# EAGLE design p2cled-001 (EAGLE 9.5.2)
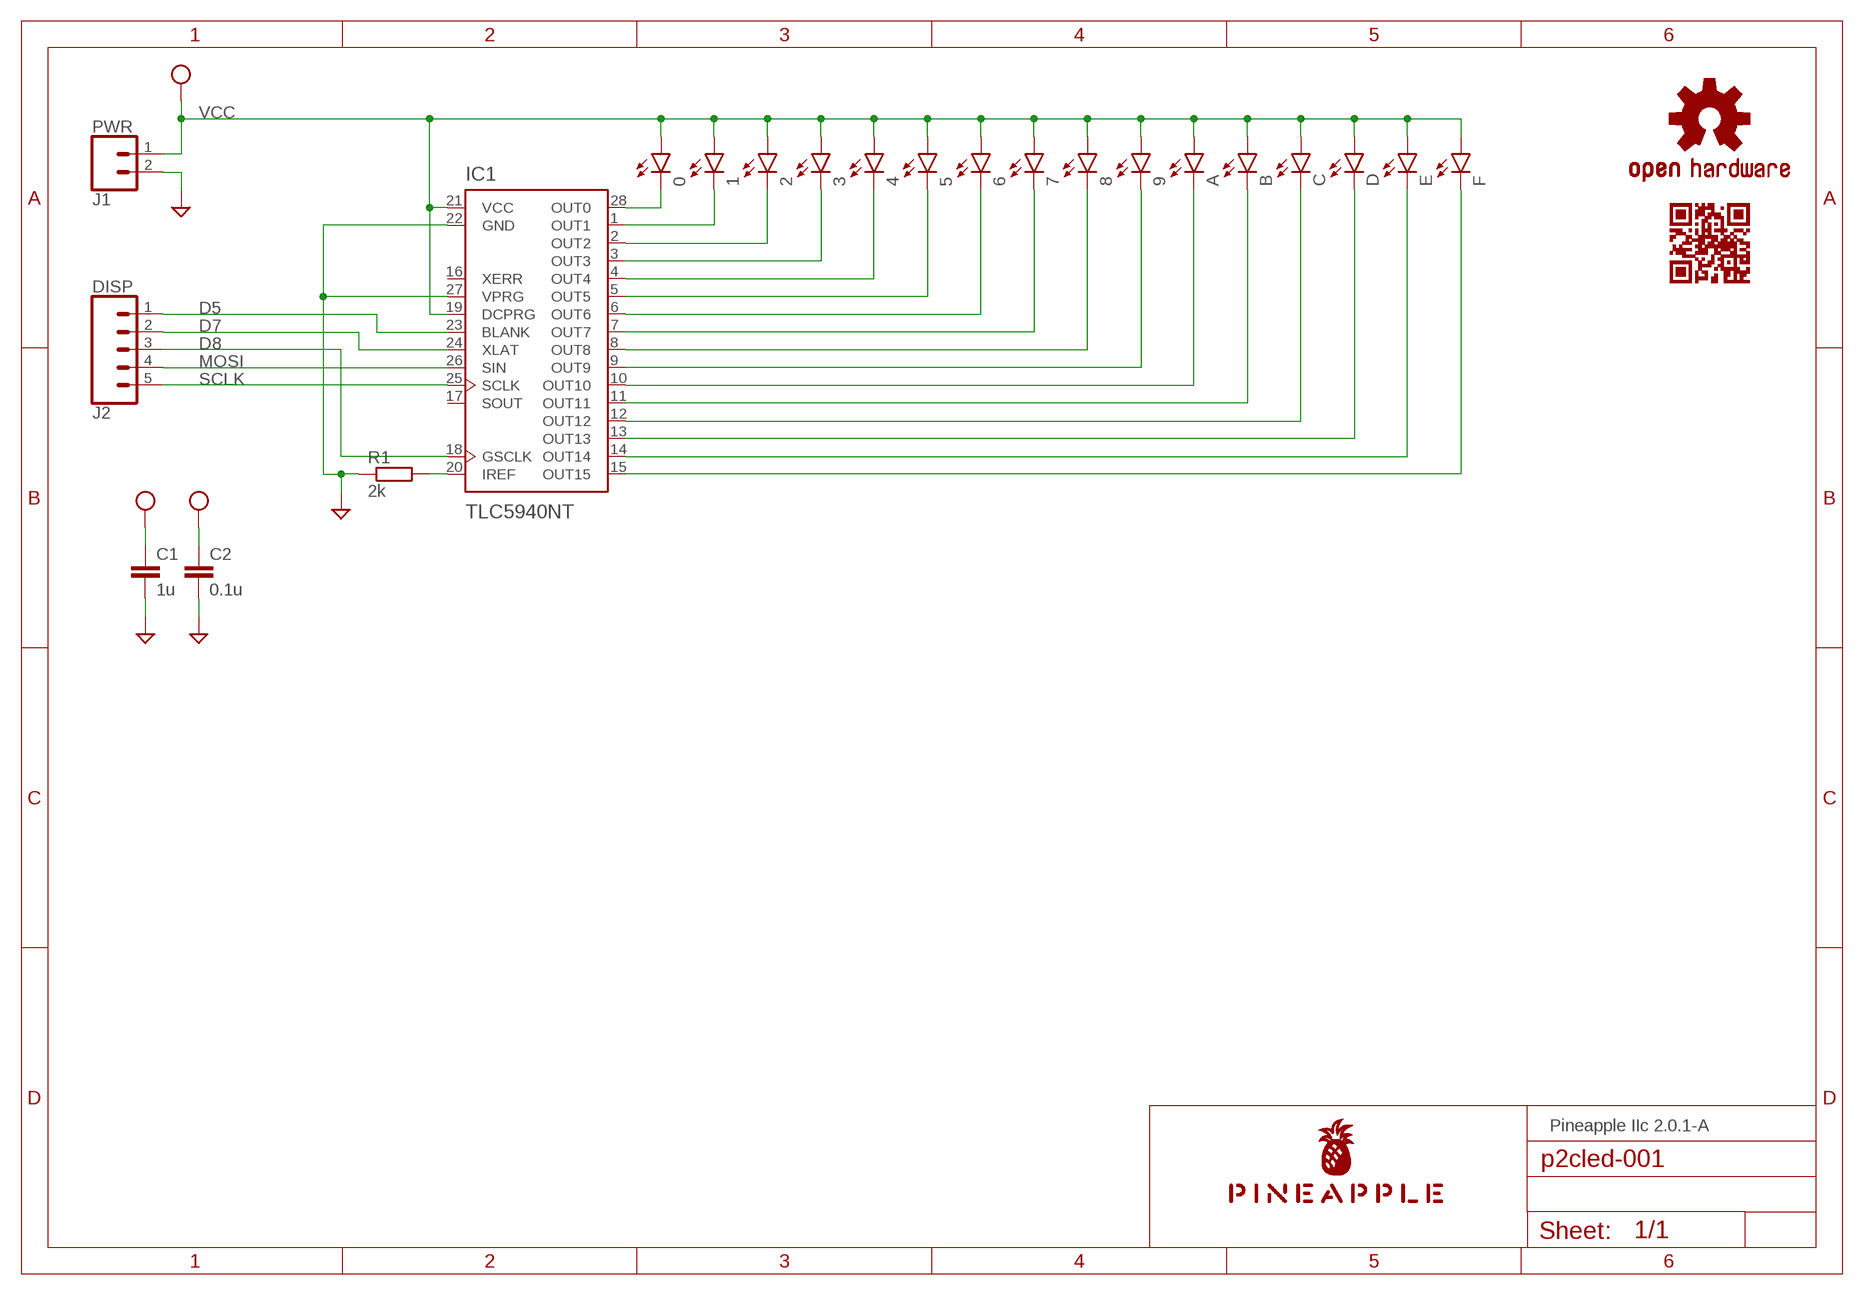
[diagram p0: schematic, sheet 1]

## Parts
0  LEDB152  [Q62902-B152]
1  LEDB152  [Q62902-B152]
2  LEDB152  [Q62902-B152]
3  LEDB152  [Q62902-B152]
4  LEDB152  [Q62902-B152]
5  LEDB152  [Q62902-B152]
6  LEDB152  [Q62902-B152]
7  LEDB152  [Q62902-B152]
8  LEDB152  [Q62902-B152]
9  LEDB152  [Q62902-B152]
A  LEDB152  [Q62902-B152]
B  LEDB152  [Q62902-B152]
C  LEDB152  [Q62902-B152]
C1  1u  C-EU025-024X044  [C025-024X044]
C2  0.1u  C-EU025-024X044  [C025-024X044]
D  LEDB152  [Q62902-B152]
E  LEDB152  [Q62902-B152]
F  LEDB152  [Q62902-B152]
IC1  TLC5940NT  [DIL28-3]
J1  PWR  CONN_02JST-PTH-2  [JST-2-PTH]
J2  DISP  CONN_05JST  [JST-5-PTH]
LOGO1  OSHW-LOGOS-COPPER  [OSHW-LOGO-S_COPPER]
R1  2k  R-EU_0204/5  [0204/5]
U$1  PINEAPPLE450_SILK  [PINEAPPLE450_SILK]
U$4  CARDQRCODE450_SILK  [CARDQRCODE450_SILK]

## Nets
D5: IC1.23(BLANK) J2.1
D7: IC1.24(XLAT) J2.2
D8: IC1.18(GSCLK) J2.3
GND [ground]: C1.2 C2.2 IC1.22(GND) IC1.27(VPRG) J1.2 R1.1
MOSI: IC1.26(SIN) J2.4
N$1: 0.K(C) IC1.28(OUT0)
N$2: 1.K(C) IC1.1(OUT1)
N$3: 2.K(C) IC1.2(OUT2)
N$4: 3.K(C) IC1.3(OUT3)
N$5: 4.K(C) IC1.4(OUT4)
N$6: 5.K(C) IC1.5(OUT5)
N$7: 6.K(C) IC1.6(OUT6)
N$8: 7.K(C) IC1.7(OUT7)
N$9: 8.K(C) IC1.8(OUT8)
N$10: 9.K(C) IC1.9(OUT9)
N$11: A.K(C) IC1.10(OUT10)
N$12: B.K(C) IC1.11(OUT11)
N$13: C.K(C) IC1.12(OUT12)
N$14: D.K(C) IC1.13(OUT13)
N$15: E.K(C) IC1.14(OUT14)
N$16: F.K(C) IC1.15(OUT15)
N$17: IC1.20(IREF) R1.2
SCLK: IC1.25(SCLK) J2.5
VCC [power1]: 0.A 1.A 2.A 3.A 4.A 5.A 6.A 7.A 8.A 9.A A.A B.A C1.1 C2.1 C.A D.A E.A F.A IC1.19(DCPRG) IC1.21(VCC) J1.1
Unconnected: IC1.16(XERR) IC1.17(SOUT)

## Notes on the sheet
- Pineapple IIc 2.0.1-A

## Library data of the parts
0 1-9 A B C D E F = led:LED: LED OSRAM: - CHIPLED LG R971, LG N971, LY N971, LG Q971, LY Q971, LO R971, LY R971 LH N974, LH R974 LS Q976, LO Q976, LY Q976 LO Q996 - Hyper CHIPLED LW Q18S LB Q993, LB Q99A, LB R99A - SideLED LS A670, LO A670, LY A670, LG A670, LP A670 LB A673, LV A673, LT A673, LW A673 LH A674 LY A675 LS A676, LA A676, LO A676, LY A676, LW A676 LS A679, LY A679, LG A679 - Hyper Micro SIDELED® LS Y876, LA Y876, LO Y876, LY Y876 LT Y87S - SmartLED LW L88C, LW L88S LB L89C, LB L89S, LG L890 LS L89K, LO L89K, LY L89K LS L896, LA L896, LO L896, LY L896 - TOPLED LS T670, LO T670, LY T670, LG T670, LP T670 LSG T670, LSP T670, LSY T670, LOP T670, LYG T670 LG T671, LOG T671, LSG T671 LB T673, LV T673, LT T673, LW T673 LH T674 LS T676, LA T676, LO T676, LY T676, LB T676, LH T676, LSB T676, LW T676 LB T67C, LV T67C, LT T67C, LS T67K, LO T67K, LY T67K, LW E67C LS E67B, LA E67B, LO E67B, LY E67B, LB E67C, LV E67C, LT E67C LW T67C LS T679, LY T679, LG T679 LS T770, LO T770, LY T770, LG T770, LP T770 LB T773, LV T773, LT T773, LW T773 LH T774 LS E675, LA E675, LY E675, LS T675 LS T776, LA T776, LO T776, LY T776, LB T776 LHGB T686 LT T68C, LB T68C - Hyper Mini TOPLED® LB M676 - Mini TOPLED Santana® LG M470 LS M47K, LO M47K, LY M47K Source: http://www.osram.convergy.de LUXEON: - LUMILED® LXK2-PW12-R00, LXK2-PW12-S00, LXK2-PW14-U00, LXK2-PW14-V00 LXK2-PM12-R00, LXK2-PM12-S00, LXK2-PM14-U00 LXK2-PE12-Q00, LXK2-PE12-R00, LXK2-PE12-S00, LXK2-PE14-T00, LXK2-PE14-U00 LXK2-PB12-K00, LXK2-PB12-L00, LXK2-PB12-M00, LXK2-PB14-N00, LXK2-PB14-P00, LXK2-PB14-Q00 LXK2-PR12-L00, LXK2-PR12-M00, LXK2-PR14-Q00, LXK2-PR14-R00 LXK2-PD12-Q00, LXK2-PD12-R00, LXK2-PD12-S00 LXK2-PH12-R00, LXK2-PH12-S00 LXK2-PL12-P00, LXK2-PL12-Q00, LXK2-PL12-R00 Source: www.luxeon.com KINGBRIGHT: KA-3528ASYC Source: www.kingbright.com
C1 C2 = resistor:C-EU: CAPACITOR, European symbol
IC1 = tlc5940:TLC5940
J1 = SparkFun-Connectors:CONN_02: Multi connection point. Often used as Generic Header-pin footprint for 0.1 inch spaced/style header connections On any of the 0.1 inch spaced packages, you can populate with these: Break Away Headers - Straight <https://www.sparkfun.com/products/116> (PRT-00116) Break Away Male Headers - Right Angle <https://www.sparkfun.com/products/553> (PRT-00553) Female Headers <https://www.sparkfun.com/products/115> (PRT-00115) Break Away Headers - Machine Pin <https://www.sparkfun.com/products/117> (PRT-00117) Break Away Female Headers - Swiss Machine Pin <https://www.sparkfun.com/products/743> (PRT-00743) For SCREWTERMINALS and SPRING TERMINALS visit here: Screw Terimnals on SparkFun.com <https://www.sparkfun.com/search/results?term=Screw+Terminals> (5mm/3.5mm/2.54mm spacing) This device is also useful as a general connection point to wire up your design to another part of your project. Our various solder wires solder well into these plated through hole pads. Hook-Up Wire - Assortment (Stranded, 22 AWG) <https://www.sparkfun.com/products/11375> (PRT-11375) Hook-Up Wire - Assortment (Solid Core, 22 AWG) <https://www.sparkfun.com/products/11367> (PRT-11367) View the entire wire category on our website here <https://www.sparkfun.com/categories/141> Special notes: Molex polarized connector foot print use with: PRT-08233 with associated crimp pins and housings. 2.54_SCREWTERM for use with PRT-10571. 3.5mm Screw Terminal footprints for PRT-08084 5mm Screw Terminal footprints for use with PRT-08432; PROD_ID: CONN-09863; SKU: PRT-09914
J2 = SparkFun-Connectors:CONN_05: Multi connection point. Often used as Generic Header-pin footprint for 0.1 inch spaced/style header connections On any of the 0.1 inch spaced packages, you can populate with these: Break Away Headers - Straight <https://www.sparkfun.com/products/116> (PRT-00116) Break Away Male Headers - Right Angle <https://www.sparkfun.com/products/553> (PRT-00553) Female Headers <https://www.sparkfun.com/products/115> (PRT-00115) Break Away Headers - Machine Pin <https://www.sparkfun.com/products/117> (PRT-00117) Break Away Female Headers - Swiss Machine Pin <https://www.sparkfun.com/products/743> (PRT-00743) For SCREWTERMINALS and SPRING TERMINALS visit here: Screw Terimnals on SparkFun.com <https://www.sparkfun.com/search/results?term=Screw+Terminals> (5mm/3.5mm/2.54mm spacing) This device is also useful as a general connection point to wire up your design to another part of your project. Our various solder wires solder well into these plated through hole pads. Hook-Up Wire - Assortment (Stranded, 22 AWG) <https://www.sparkfun.com/products/11375> (PRT-11375) Hook-Up Wire - Assortment (Solid Core, 22 AWG) <https://www.sparkfun.com/products/11367> (PRT-11367) View the entire wire category on our website here <https://www.sparkfun.com/categories/141> Special notes: Molex polarized connector foot print use with SKU : PRT-08231 with associated crimp pins and housings. 1MM SMD Version SKU: PRT-10208; SF_ID: PRT-09917
LOGO1 = SparkFun-Aesthetics:OSHW-LOGO: Open-Source Hardware (OSHW) Logo This logo indicates the piece of hardware it is found on incorporates a OSHW license and/or adheres to the definition of open source hardware found here: http://freedomdefined.org/OSHW
R1 = resistor:R-EU_: RESISTOR, European symbol
U$1 = pineapple:PINEAPPLE450_SILK
U$4 = pineapple:CARDQRCODE450_SILK

## Net classes
0 default: width 0.152 mm, drill 0.305 mm, clearance 0.152 mm
1 ground: width 0.61 mm, drill 0.305 mm, clearance 0.152 mm
2 power1: width 0.61 mm, drill 0.305 mm, clearance 0.152 mm
3 power2: width 0.305 mm, drill 0.305 mm, clearance 0.152 mm

## Board
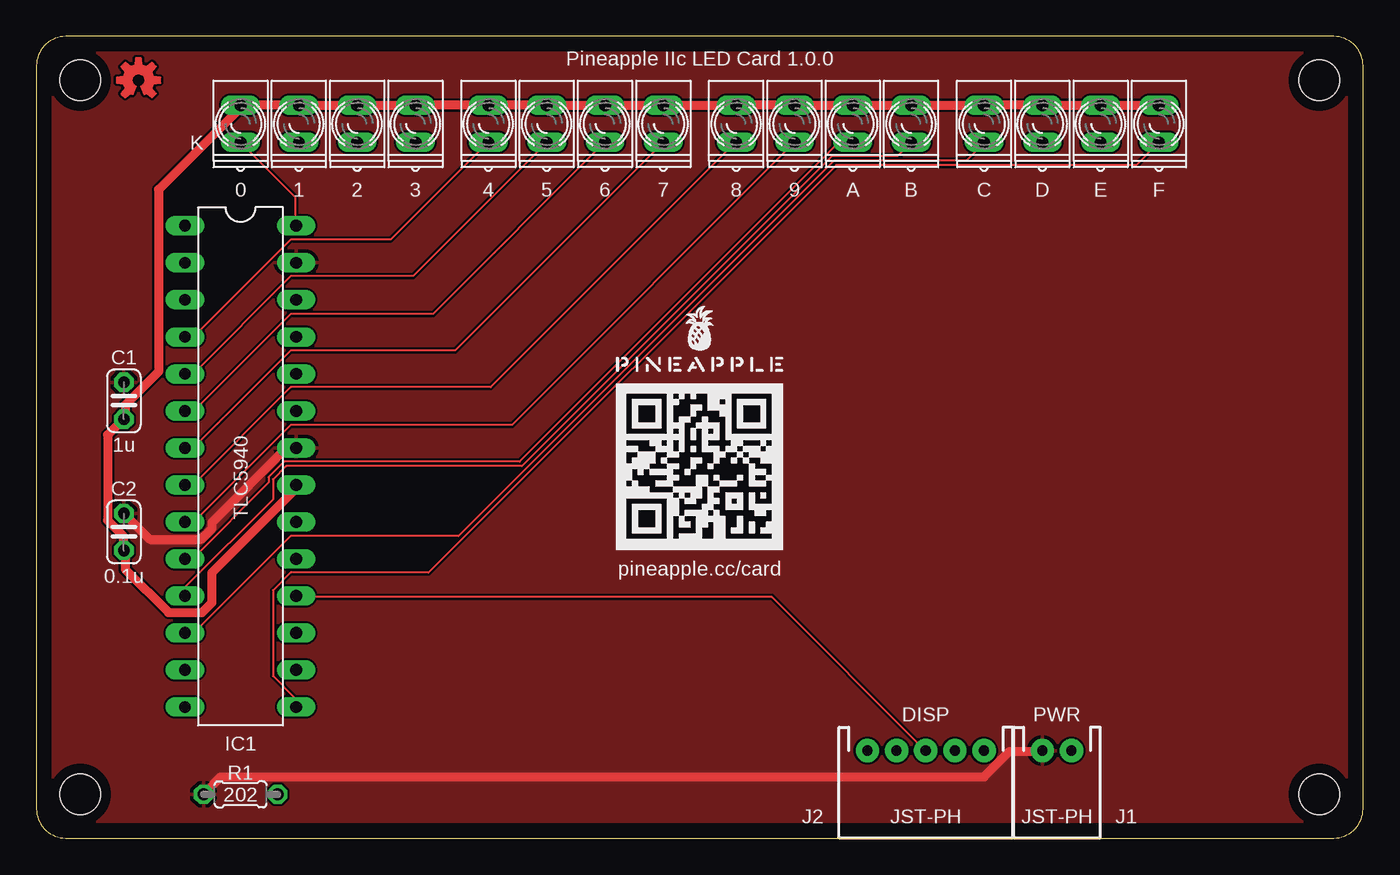
[diagram p1: board, top side]
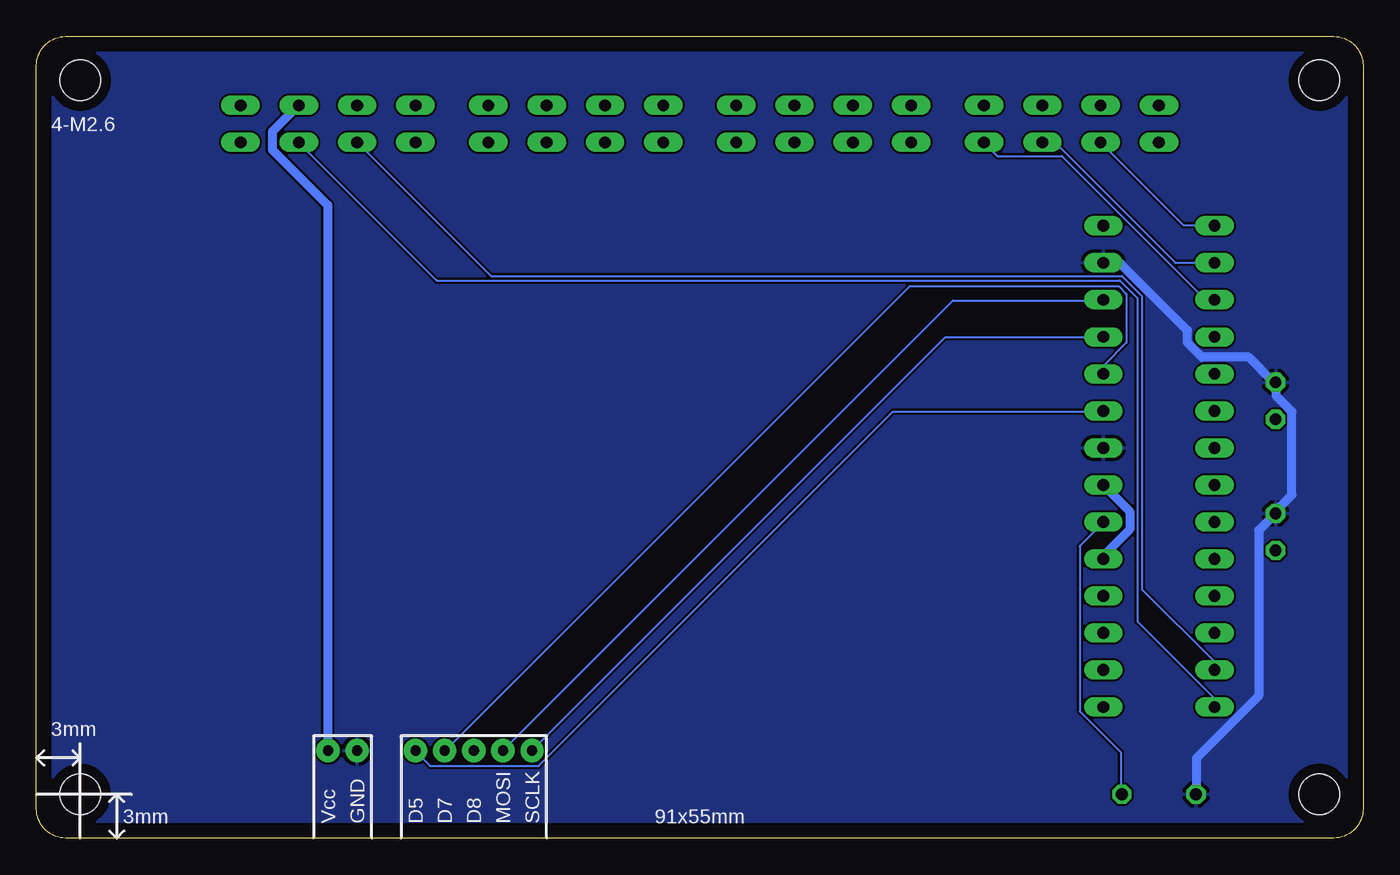
[diagram p2: board, bottom side, seen from below]

Size 91 x 55 mm. Coordinates in mm from the lower left corner, seen from the top.
Outline: 0,53 0,2 arc90 2,0 89,0 arc90 91,2 91,53 arc90 89,55 2,55 arc90 0,53
Copper layers (1*16): Top 0.035mm / dielectric 1.5mm / Bottom 0.035mm
Design rules "SeeedStudio_2layer_DRU_no_angle_20140221": minimum track width 6mil, minimum drill 12mil, track to track 6mil, track to pad 6mil, pad to pad 6mil, via to via 6mil, smd to smd 0mil, copper to edge 10mil, drill to drill 10mil, minimum pad ring 10mil, minimum via ring 6mil, stop-mask expansion 2mil, vias tented up to drill 100mil, thermal gap 10mil
Holes 2.8 mm at 3,3 3,52 88,52 88,3
tRestrict: area 0,0 to 91,1; area 90,0 to 91,55; area 0,54 to 91,55; area 0,0 to 1,55; area 1,50 to 5,54; area 1,1 to 5,5; area 86,1 to 90,5; area 86,50 to 90,54; area 40,20 to 51,31
bRestrict: area 0,0 to 91,1; area 90,0 to 91,55; area 0,54 to 91,55; area 0,0 to 1,55; area 86,50 to 90,54; area 86,1 to 90,5; area 1,50 to 5,54; area 1,1 to 5,5

### Footprints (pad centres in the part's own frame; a part is rotated, then mirrored left to right if it is on the bottom)
Q62902-B152 = drill 0.813 long: A 1.27,0; K -1.27,0
C025-024X044 = drill 0.813 octagon: 1 -1.27,0; 2 1.27,0
DIL28-3 = drill 0.813 long: 1 -16.51,-3.81; 2 -13.97,-3.81; 3 -11.43,-3.81; 4 -8.89,-3.81; 5 -6.35,-3.81; 6 -3.81,-3.81; 7 -1.27,-3.81; 8 1.27,-3.81; 9 3.81,-3.81; 10 6.35,-3.81; 11 8.89,-3.81; 12 11.43,-3.81; 13 13.97,-3.81; 14 16.51,-3.81; 15 16.51,3.81; 16 13.97,3.81; 17 11.43,3.81; 18 8.89,3.81; 19 6.35,3.81; 20 3.81,3.81; 21 1.27,3.81; 22 -1.27,3.81; 23 -3.81,3.81; 24 -6.35,3.81; 25 -8.89,3.81; 26 -11.43,3.81; 27 -13.97,3.81; 28 -16.51,3.81
JST-2-PTH = drill 0.7 pad 1.6: 1 -1,0; 2 1,0
JST-5-PTH = drill 0.7 pad 1.6: 1 -4,0; 2 -2,0; 3 0,0; 4 2,0; 5 4,0
0204/5 = drill 0.813 octagon: 1 -2.54,0; 2 2.54,0

### Placement (x,y rotation side)
0  14,49 90 top
1  18,49 90 top
2  22,49 90 top
3  26,49 90 top
4  31,49 90 top
5  35,49 90 top
6  39,49 90 top
7  43,49 90 top
8  48,49 90 top
9  52,49 90 top
A  56,49 90 top
B  60,49 90 top
C  65,49 90 top
C1  6,30 90 top
C2  6,21 90 top
D  69,49 90 top
E  73,49 90 top
F  77,49 90 top
IC1  14,25.5 270 top
J1  70,6 180 top
J2  61,6 180 top
LOGO1  7,52 0 top
R1  14,3 0 top
U$1  45.5,32 0 top
U$4  45.5,25.5 0 top

### Tracks (layer width: path | path; a pad name or v marks a point on that pad's centre or on a via)
D5
  Bottom 0.152: IC1.23 17.83,29.26 32.23,29.26 56.54,4.95 64.01,4.95 65,5.94 J2.1
D7
  Bottom 0.152: IC1.24 17.75,31.85 17.75,32.46 16.23,33.98 16.23,37.34 16.76,37.87 31.09,37.87 62.94,6.02 J2.2
D8
  Top 0.152: IC1.18 17.83,16.54 50.44,16.54 60.96,6.02 J2.3
GND
  Top 0.61: IC1.22 17.75,26.75 17.14,26.75 12.04,21.64 12.04,21.26 11.28,20.5 7.77,20.5 6.02,22.25 C2.2 | J1.2 68.96,5.94 66.75,5.94 65,4.19 12.65,4.19 11.51,3.05 R1.1
  Bottom 0.61: R1.1 11.43,3.05 11.43,5.49 7.16,9.75 7.16,21.11 6.02,22.25 C2.2 5.87,22.55 4.88,23.55 4.88,29.26 5.94,30.33 5.94,31.24 C1.2 6.25,31.39 7.85,32.99 11.05,32.99 12.04,33.98 12.04,34.82 16.61,39.4 17.75,39.4 IC1.27
  pour Top: -1,-1 92,-1 92,56 -1,56
  pour Bottom: -2,-2 93,-2 93,57 -2,57
MOSI
  Bottom 0.152: IC1.26 17.83,36.88 28.12,36.88 58.98,6.02 J2.4
N$1
  Top 0.152: IC1.28 17.75,42.06 17.75,43.97 14.02,47.7 0.K
N$2
  Bottom 0.152: IC1.1 10.21,42.06 12.34,42.06 17.98,47.7 1.K
N$3
  Bottom 0.152: IC1.2 10.21,39.47 12.88,39.47 21.11,47.7 21.95,47.7 2.K
N$4
  Bottom 0.152: IC1.3 10.21,36.96 10.82,36.96 20.65,46.79 25.07,46.79 25.98,47.7 3.K
N$5
  Top 0.152: IC1.4 10.21,34.44 10.82,34.44 17.45,41.07 24.31,41.07 30.94,47.7 4.K
N$6
  Top 0.152: IC1.5 10.21,31.85 10.74,31.85 17.45,38.56 25.83,38.56 34.98,47.7 5.K
N$7
  Top 0.152: IC1.6 10.21,29.34 10.82,29.34 17.45,35.97 27.2,35.97 38.94,47.7 6.K
N$8
  Top 0.152: IC1.7 10.21,26.82 10.82,26.82 17.45,33.45 28.73,33.45 42.98,47.7 7.K
N$9
  Top 0.152: IC1.8 10.21,24.23 10.74,24.23 17.45,30.94 31.17,30.94 47.93,47.7 8.K
N$10
  Top 0.152: IC1.9 10.21,21.72 10.82,21.72 17.45,28.35 32.61,28.35 51.97,47.7 9.K
N$11
  Top 0.152: IC1.10 10.21,19.2 10.74,19.2 15.93,24.38 15.93,24.77 16.99,25.83 33.15,25.83 55.02,47.7 55.93,47.7 A.K
N$12
  Top 0.152: IC1.11 10.21,16.61 10.21,17.22 16.23,23.24 16.23,24.61 17.14,25.53 33.3,25.53 54.56,46.79 59.05,46.79 59.97,47.7 B.K
N$13
  Top 0.152: IC1.12 10.21,14.1 10.82,14.1 17.45,20.73 28.96,20.73 54.71,46.48 63.78,46.48 65,47.7 C.K
N$14
  Bottom 0.152: IC1.13 10.21,11.58 10.21,12.12 15.16,17.07 15.16,37.19 16.54,38.56 59.82,38.56 68.96,47.7 D.K
N$15
  Bottom 0.152: IC1.14 10.21,8.99 10.21,9.6 15.47,14.86 15.47,37.03 16.69,38.25 63.55,38.25 73,47.7 E.K
N$16
  Top 0.152: IC1.15 17.75,8.99 17.75,9.6 16.23,11.12 16.23,16.99 17.45,18.21 26.9,18.21 54.86,46.18 75.44,46.18 76.96,47.7 F.K
N$17
  Bottom 0.152: R1.2 16.61,3.05 16.61,5.87 19.43,8.69 19.43,20.04 17.83,21.64 IC1.20
SCLK
  Bottom 0.152: IC1.25 17.83,34.37 28.65,34.37 57,6.02 J2.5
VCC
  Top 0.61: F.A 76.96,50.29 73.3,50.29 E.A 73,50.29 69.27,50.29 D.A 68.96,50.29 65.08,50.29 C.A 64.69,50.29 60.27,50.29 B.A 59.97,50.29 56.31,50.29 A.A 55.93,50.29 52.27,50.29 9.A 51.97,50.29 48.01,50.29 8.A 47.7,50.29 43.28,50.29 7.A 42.98,50.29 39.32,50.29 6.A 38.94,50.29 35.28,50.29 5.A 34.98,50.29 31.01,50.29 4.A 30.71,50.29 26.29,50.29 3.A 25.98,50.29 22.25,50.29 2.A 21.95,50.29 18.29,50.29 1.A 17.98,50.29 14.02,50.29 0.A 13.87,49.99 8.38,44.5 8.38,32 6.1,29.72 6.1,29.03 C1.1 5.94,28.73 4.88,27.66 4.88,21.79 5.94,20.73 5.94,19.74 C2.1 6.1,19.43 6.1,18.44 9.07,15.47 11.35,15.47 12.04,16.15 12.04,18.21 17.75,23.93 17.75,24.16 IC1.21
  Bottom 0.61: J1.1 71.02,6.02 71.02,43.43 74.83,47.24 74.83,48.46 73.08,50.22 E.A | IC1.19 17.75,19.2 17.75,19.43 16,21.18 16,22.4 17.75,24.16 IC1.21

### Text on the board
tNames: Pineapple IIc LED Card 1.0.0 | K | 1u | TLC5940 | 0.1u | pineapple.cc/card | DISP | PWR | 202 | JST-PH | JST-PH
bNames: 4-M2.6 | 3mm | 91x55mm | SCLK | MOSI | D8 | D7 | D5 | GND | Vcc | 3mm